# Altium schematic sheet AVRKernel.SchDoc
size A4
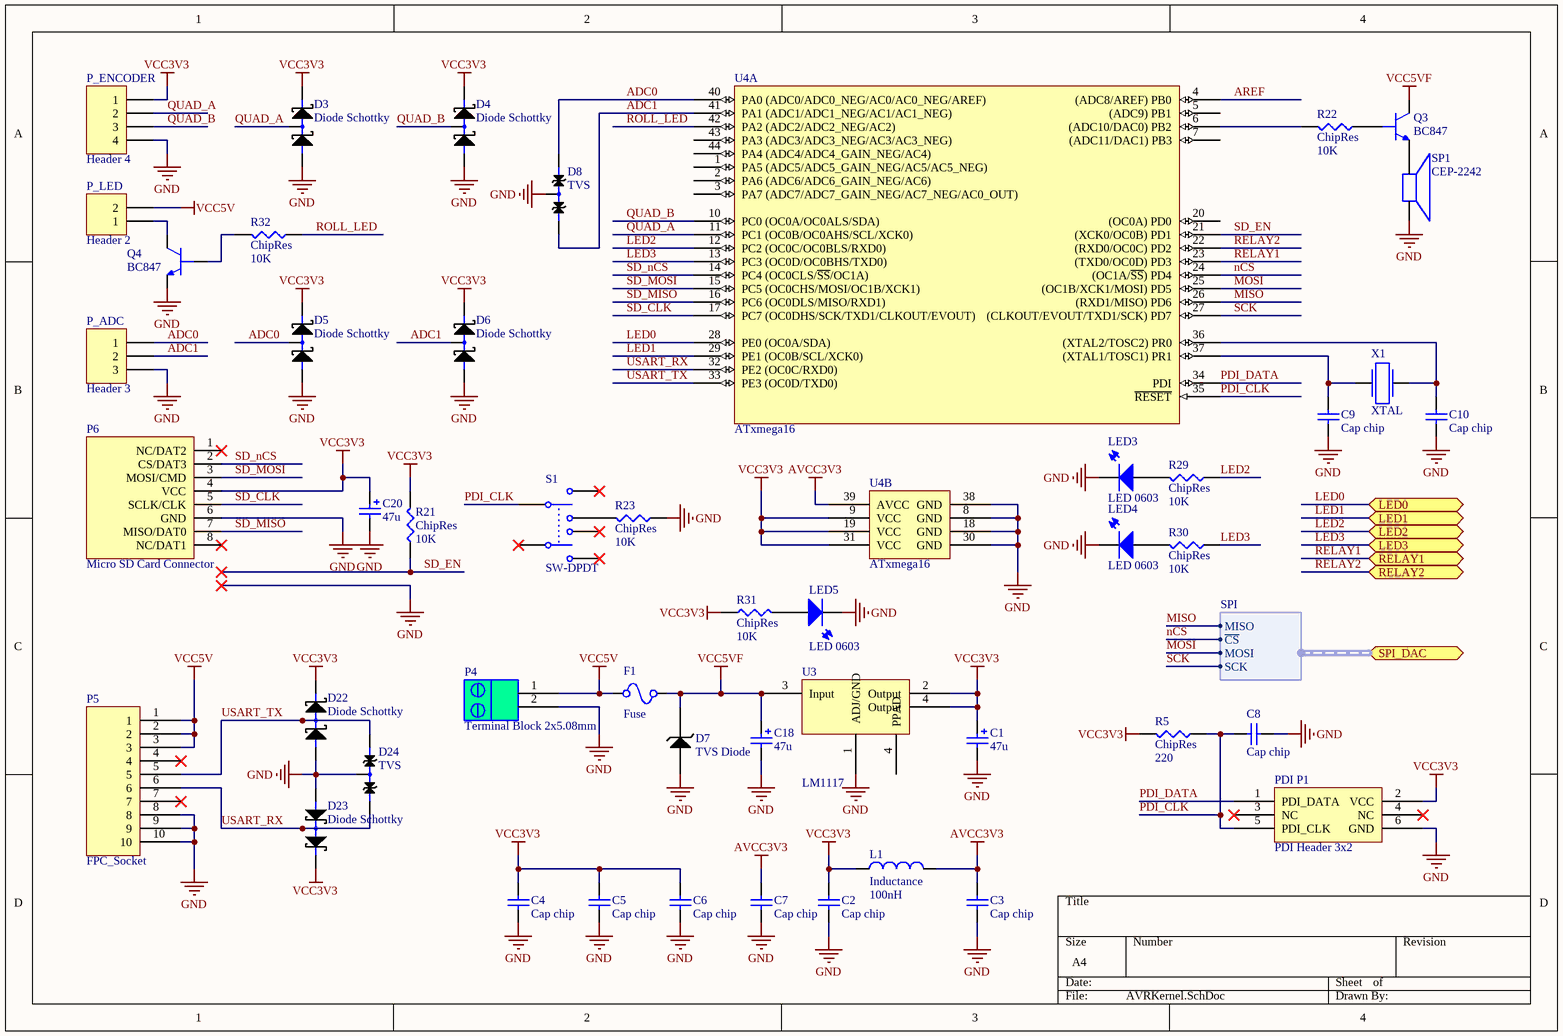
[diagram p0: AVRKernel.SchDoc]

## Parts
C1  value 47u  [CAPC7343]  (hidden comment: Cap Pol SMD)
C2  Cap chip  [CAPC3216]
C3  Cap chip  [CAPC3216]
C4  Cap chip  [CAPC3216]
C5  Cap chip  [CAPC3216]
C6  Cap chip  [CAPC3216]
C7  Cap chip  [CAPC3216]
C8  Cap chip  [CAPC3216]
C9  Cap chip  [CAPC3216]
C10  Cap chip  [CAPC3216]
C18  value 47u  [CAPC7343]  (hidden comment: Cap Pol SMD)
C20  value 47u  [CAPC7343]  (hidden comment: Cap Pol SMD)
D3  Diode Schottky  [SOT23]
D4  Diode Schottky  [SOT23]
D5  Diode Schottky  [SOT23]
D6  Diode Schottky  [SOT23]
D7  TVS Diode  [DO-214AS]
D8  TVS  [SOT23]
D22  Diode Schottky  [SOT23]
D23  Diode Schottky  [SOT23]
D24  TVS  [SOT23]
F1  Fuse  [PTC1812]
L1  Inductance  value 100nH  [CM45]
LED3  LED 0603  [LED 0603]
LED4  LED 0603  [LED 0603]
LED5  LED 0603  [LED 0603]
P4  Terminal Block 2x5.08mm  [Socket 2x5.08]
P5  FPC_Socket  [Molex FPC/FFC 10pin]
P6  Micro SD Card Connector  [WR-CRD SD Micro]
P_ADC  Header 3  [HDR1X3]
P_ENCODER  Header 4  [HDR1X4]
P_LED  Header 2  [HDR1X2]
PDI_P1  PDI Header 3x2  [Header 3x2]
Q3  BC847  [SOT23]
Q4  BC847  [SOT23]
R5  ChipRes  value 220  [RES0805]
R21  ChipRes  value 10K  [RES0805]
R22  ChipRes  value 10K  [RES0805]
R23  ChipRes  value 10K  [RES0805]
R29  ChipRes  value 10K  [RES0805]
R30  ChipRes  value 10K  [RES0805]
R31  ChipRes  value 10K  [RES0805]
R32  ChipRes  value 10K  [RES0805]
S1  SW-DPDT  [DPDT-6]
SP1  CEP-2242  [Buzzer]
U3  LM1117  [SOT223-4M]
U4  ATxmega16  [44A_L]  (parts A,B of 2)
X1  XTAL  [BCY-W2/E4.7]

## Ports
LED0, LED1, LED2, LED3, RELAY1, RELAY2, SPI_DAC (harness SPI)

## Harnesses
SPI: MOSI, MISO, SCK, ~{CS}

## Nets
AVCC3V3: C3.1 C7.2 L1.1 U4.39(AVCC)
GND: C1.2 C2.2 C3.2 C4.1 C5.1 C6.1 C7.1 C8.1 C9.1 C10.1 C18.2 C20.2 D3.1 D4.1 D5.1 D6.1 D7.2 D8.3 D22.1 D23.1 D24.3 LED3.1 LED4.1 LED5.1 P4.2 P5.8 P5.9 P5.10 P6.6(GND) P_ADC.3 P_ENCODER.4 PDI_P1.6(GND) Q4.2 R23.1 SP1.2 U3.1(ADJ/GND) U4.8(GND) U4.18(GND) U4.30(GND) U4.38(GND)
VCC3V3: C1.1 C2.1 C4.2 C5.2 C6.2 C20.1 D3.2 D4.2 D5.2 D6.2 D22.2 D23.2 L1.2 P6.4(VCC) P_ENCODER.1 PDI_P1.2(VCC) R5.2 R21.2 R31.1 U3.2(Output) U3.4(PPAD) U4.9(VCC) U4.19(VCC) U4.31(VCC)
VCC5V: F1.1 P4.1 P5.1 P5.2 P5.3 P_LED.2
VCC5VF: C18.1 D7.1 F1.2 Q3.3 U3.3(Input)
ADC0: D5.3 D8.1 P_ADC.1 U4.40(PA0_(ADC0/ADC0_NEG/AC0/AC0_NEG/AREF))
ADC1: D6.3 D8.2 P_ADC.2 U4.41(PA1_(ADC1/ADC1_NEG/AC1/AC1_NEG))
AREF: U4.4((ADC8/AREF)_PB0)
LED0: U4.28(PE0_(OC0A/SDA)) ; port LED0
LED1: U4.29(PE1_(OC0B/SCL/XCK0)) ; port LED1
LED2: R29.1 U4.12(PC2_(OC0C/OC0BLS/RXD0)) ; port LED2
LED3: R30.1 U4.13(PC3_(OC0D/OC0BHS/TXD0)) ; port LED3
MISO: U4.26((RXD1/MISO)_PD6) ; port SPI_DAC.MISO
MOSI: U4.25((OC1B/XCK1/MOSI)_PD5) ; port SPI_DAC.MOSI
nCS: U4.24((OC1A/~{SS})_PD4) ; port SPI_DAC.~{CS}
PDI_CLK: C8.2 PDI_P1.5(PDI_CLK) R5.1 S1.1 U4.35(~{RESET})
PDI_DATA: PDI_P1.1(PDI_DATA) U4.34(PDI)
QUAD_A: D3.3 P_ENCODER.2 U4.11(PC1_(OC0B/OC0AHS/SCL/XCK0))
QUAD_B: D4.3 P_ENCODER.3 U4.10(PC0_(OC0A/OC0ALS/SDA))
RELAY1: U4.23((TXD0/OC0D)_PD3) ; port RELAY1
RELAY2: U4.22((RXD0/OC0C)_PD2) ; port RELAY2
ROLL_LED: R32.1 U4.42(PA2_(ADC2/ADC2_NEG/AC2))
SCK: U4.27((CLKOUT/EVOUT/TXD1/SCK)_PD7) ; port SPI_DAC.SCK
SD_CLK: P6.5(SCLK/CLK) U4.17(PC7_(OC0DHS/SCK/TXD1/CLKOUT/EVOUT))
SD_EN: R21.1 U4.21((XCK0/OC0B)_PD1)
SD_MISO: P6.7(MISO/DAT0) U4.16(PC6_(OC0DLS/MISO/RXD1))
SD_MOSI: P6.3(MOSI/CMD) U4.15(PC5_(OC0CHS/MOSI/OC1B/XCK1))
SD_nCS: P6.2(CS/DAT3) U4.14(PC4_(OC0CLS/~{SS}/OC1A))
USART_RX: D23.3 D24.2 P5.6 U4.32(PE2_(OC0C/RXD0))
USART_TX: D22.3 D24.1 P5.5 U4.33(PE3_(OC0D/TXD0))
NetC9_2: C9.2 U4.37((XTAL1/TOSC1)_PR1) X1.1
NetC10_2: C10.2 U4.36((XTAL2/TOSC2)_PR0) X1.2
NetLED3_2: LED3.2 R29.2
NetLED4_2: LED4.2 R30.2
NetLED5_2: LED5.2 R31.2
NetP_LED_1: P_LED.1 Q4.3
NetQ3_1: Q3.1 R22.1
NetQ3_2: Q3.2 SP1.1
NetQ4_1: Q4.1 R32.2
NetR22_2: R22.2 U4.6((ADC10/DAC0)_PB2)
NetR23_2: R23.2 S1.3

Not connected (* = marked no-connect by the designer): P5 4* 7*; P6 1(NC/DAT2)* 8(NC/DAT1)*; PDI_P1 3(NC)* 4(NC)*; S1 2* 4* 5* 6*; U4 1(PA5_(ADC5/ADC5_GAIN_NEG/AC5/AC5_NEG)) 2(PA6_(ADC6/ADC6_GAIN_NEG/AC6)) 3(PA7_(ADC7/ADC7_GAIN_NEG/AC7_NEG/AC0_OUT)) 5((ADC9)_PB1) 7((ADC11/DAC1)_PB3) 20((OC0A)_PD0) 43(PA3_(ADC3/ADC3_NEG/AC3/AC3_NEG)) 44(PA4_(ADC4/ADC4_GAIN_NEG/AC4))

## Library data of the parts
C1 C18 C20 = Cap Pol Chip: Polarized Capacitor (Radial); Supplier 1: Digi-Key; Supplier Part Number 1: 399-4029-1-ND
C2-C10 = Cap chip: Chip Capacitor; Value: 0.01uF; Published: 8-Jun-2000; LatestRevisionDate: 17-Jul-2002; LatestRevisionNote: Re-released for DXP Platform.; PackageReference: RAD-0.3; Publisher: Altium Limited; Supplier 1: Digi-Key; Supplier Part Number 1: 399-1249-1-ND
D3-D6 D22 D23 = Schottky Diode: 2-Diode Schottky
D7 = TVS Diode SMA
D8 D24 = TVS Diode: Dual bidirectional voltage supresor
F1 = Fuse PTC1812: Fuse PTC 1812 Thermoresistor
L1 = ChipInductance
LED3-LED5 = LED0603
P4 = Socket_2x5.08_RA_2Wall: Terminal Block Socket Right Angle 2x5.08mm 2 Wall
P6 = MicroSDHeader8
P_ADC = Header 3: Header, 3-Pin; LatestRevisionDate: 17-Jul-2002; LatestRevisionNote: Re-released for DXP Platform.; Publisher: Altium Limited
P_ENCODER = Header 4: Header, 4-Pin; LatestRevisionDate: 17-Jul-2002; LatestRevisionNote: Re-released for DXP Platform.; Publisher: Altium Limited
P_LED = Header 2: Header, 2-Pin; LatestRevisionDate: 17-Jul-2002; LatestRevisionNote: Re-released for DXP Platform.; Publisher: Altium Limited
PDI_P1 = PDI Header 3x2: PDI Interface connector
Q3 Q4 = BC847: NPN transistor
R5 R21-R23 R29-R32 = ChipRes: Chip resistor
S1 = SW-DPDT: Double-Pole, Double-Throw Switch; Published: 24-Mar-1999; LatestRevisionDate: 17-Jul-2002; LatestRevisionNote: Re-released for DXP Platform.; PackageReference: DPDT-6; Publisher: Altium Limited; PackageDescription: Switch; 6 Leads
SP1 = Buzzer CEP-2242: Buzzer
U3 = LM1117: Power Mgt Voltage Regulator
U4 = ATxmega16: 8-Bit AVR XMEGA Microcontroller with 16K Bytes of In-System Programmable Flash Memory
X1 = Crystall oscillator: Quartz crystall oscillator